# Altium schematic sheet Main.SchDoc
size 271 x 238 mm; SheetNumber: 1
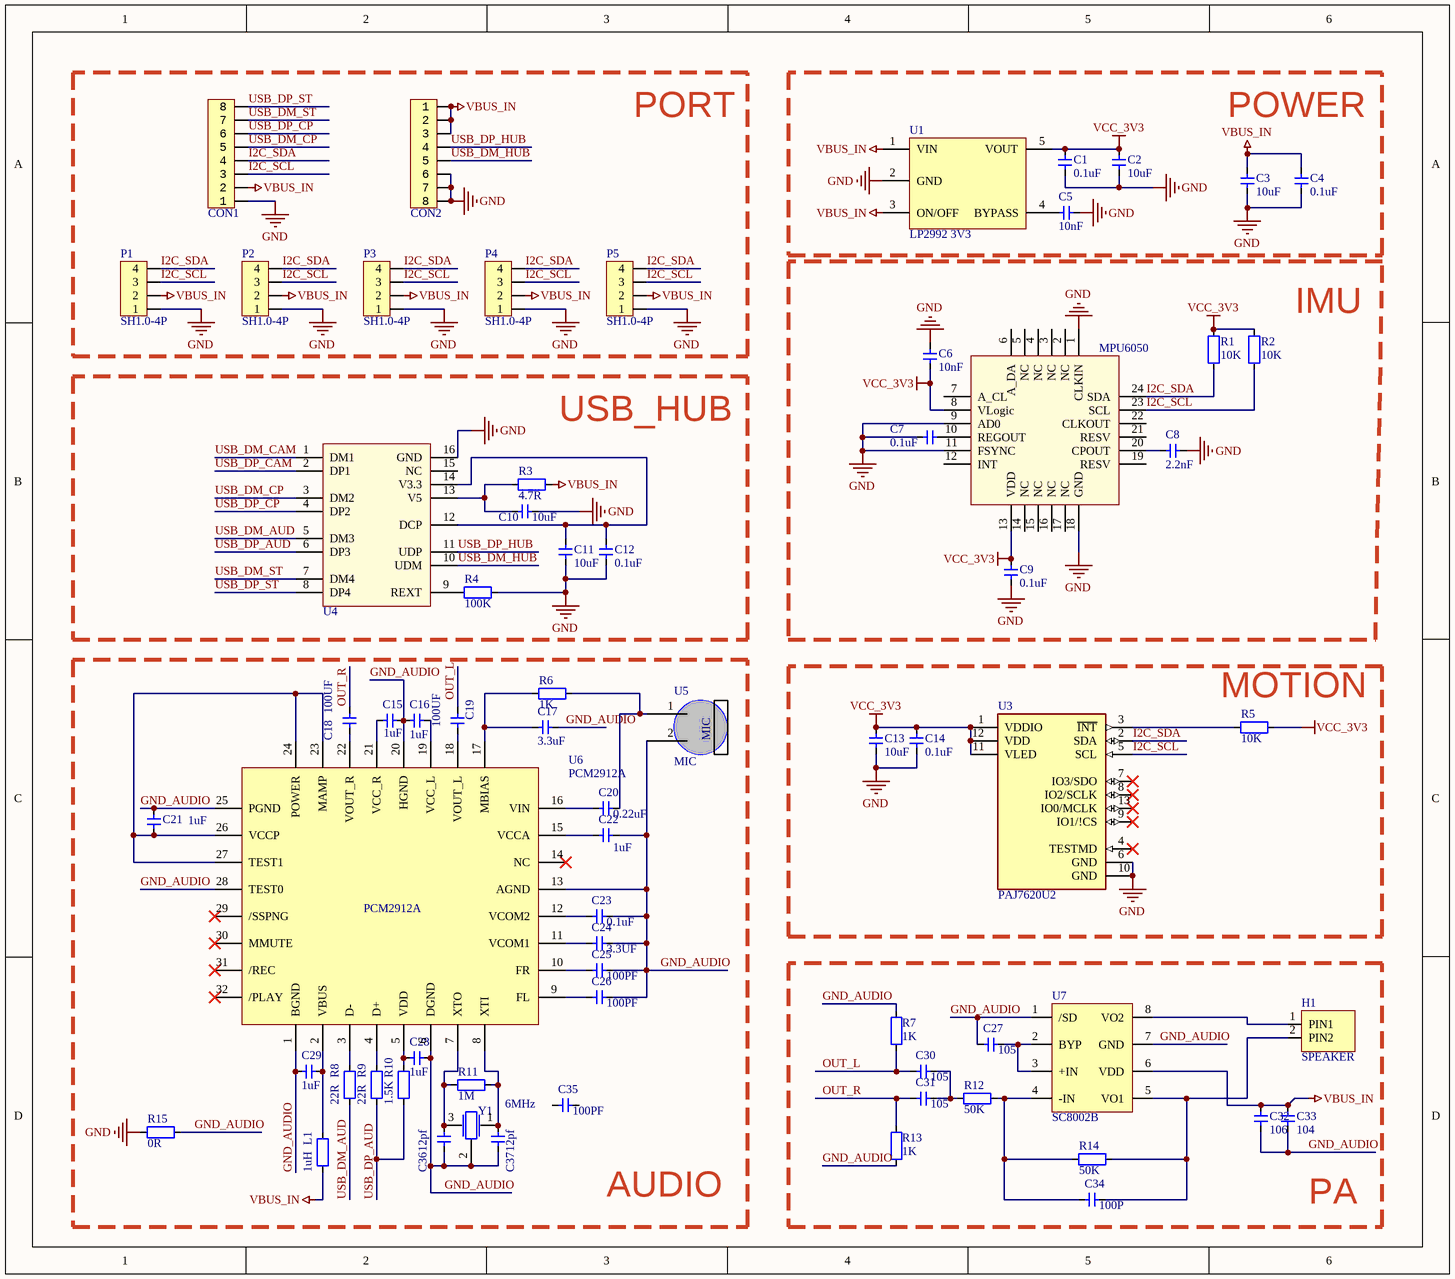
[diagram p0: Main.SchDoc]

## Parts
C1  0.1uF  [CAP_0402]
C2  10uF  [CAP_0402]
C3  10uF  [CAP_0402]
C4  0.1uF  [CAP_0402]
C5  10nF  [CAP_0402]
C6  10nF  [CAP_0402]
C7  0.1uF  [CAP_0402]
C8  2.2nF  [CAP_0402]
C9  0.1uF  [CAP_0402]
C10  10uF  [CAP_0402]
C11  10uF  [CAP_0402]
C12  0.1uF  [CAP_0402]
C13  10uF  [CAP_0402]
C14  0.1uF  [CAP_0402]
C15  1uF  [CAP_0402]
C16  1uF  [CAP_0402]
C17  3.3uF  [CAP_0402]
C18  100UF  [3225_C]
C19  100UF  [3225_C]
C20  0.22uF  [CAP_0402]
C21  1uF  [CAP_0402]
C22  1uF  [CAP_0402]
C23  0.1uF  [CAP_0402]
C24  3.3UF  [CAP_0402]
C25  100PF  [CAP_0402]
C26  100PF  [CAP_0402]
C27  105  [CAP_0402]
C28  1uF  [CAP_0402]
C29  1uF  [CAP_0402]
C30  105  [CAP_0402]
C31  105  [CAP_0402]
C32  106  [CAP_0402]
C33  104  [CAP_0402]
C34  100P  [CAP_0402]
C35  100PF  [CAP_0402]
C36  12pf  [CAP_0402]
C37  12pf  [CAP_0402]
CON1  FFC_0.5_8  [FFC_0.5_8]  (value not drawn)
CON2  FFC_0.5_8  [FFC_0.5_8]  (value not drawn)
H1  SPEAKER  [header2p_1.0]
L1  1uH  [RES_0402]
P1  SH1.0-4P  [SH1.0-4P]
P2  SH1.0-4P  [SH1.0-4P]
P3  SH1.0-4P  [SH1.0-4P]
P4  SH1.0-4P  [SH1.0-4P]
P5  SH1.0-4P  [SH1.0-4P]
R1  10K  [RES_0402]
R2  10K  [RES_0402]
R3  4.7R  [RES_0402]
R4  100K  [RES_0402]
R5  10K  [RES_0402]
R6  1K  [RES_0402]
R7  1K  [RES_0402]
R8  22R  [RES_0402]
R9  22R  [RES_0402]
R10  1.5K  [RES_0402]
R11  1M  [RES_0402]
R12  50K  [RES_0402]
R13  1K  [RES_0402]
R14  50K  [RES_0402]
R15  0R  [RES_0402]
U1  LP2992 3V3  [SOT23-5]
U2  MPU6050  [QFN-24]
U3  PAJ7620U2  [PAJ7620U2]
U4  HS8836A  [SO-16N]  (value not drawn)
U5  MIC  [MIC6*2.2]
U6  PCM2912A  [PCM2912]
U7  SC8002B  [SOP-8]
Y1  6MHz  [cystal-3P -4520]

## Blocks framed on the sheet
PORT: CON1 CON2 P1-P5
POWER: C1-C5 U1
IMU: C6-C9 R1 R2 U2
USB_HUB: C10-C12 R3 R4 U4
AUDIO: C15-C26 C28 C29 C35-C37 L1 R6 R8-R11 R15 U5 U6 Y1
MOTION: C13 C14 R5 U3
PA: C27 C30-C34 H1 R7 R12-R14 U7

## Nets
GND: C1.1 C2.1 C3.1 C4.1 C5.1 C6.2 C7.2 C8.1 C9.1 C10.1 C11.2 C12.2 C13.2 C14.2 CON1.1 CON2.6 CON2.7 CON2.8 P1.1 P2.1 P3.1 P4.1 P5.1 R4.1 R15.1 U1.2(GND) U2.1(CLKIN) U2.9(AD0) U2.11(FSYNC) U2.18(GND) U3.6(GND) U3.10(GND) U4.16(GND)
VBUS_IN: C3.2 C4.2 C32.1 C33.1 CON1.2 CON2.1 CON2.2 CON2.3 L1.2 P1.2 P2.2 P3.2 P4.2 P5.2 R3.1 U1.1(VIN) U1.3(ON/OFF) U7.6(VDD)
VCC_3V3: C1.2 C2.2 C6.1 C9.2 C13.1 C14.1 R1.2 R2.2 R5.2 U1.5(VOUT) U2.8(VLogic) U2.13(VDD) U3.1(VDDIO) U3.11(VLED) U3.12(VDD)
GND_AUDIO: C15.2 C16.2 C17.2 C21.2 C22.2 C23.1 C24.1 C25.1 C26.1 C27.2 C28.1 C29.2 C32.2 C33.2 C36.2 C37.2 R7.1 R13.1 R15.2 U5.2 U6.1(BGND) U6.6(DGND) U6.13(AGND) U6.20(HGND) U6.25(PGND) U6.28(TEST0) U7.1(/SD) U7.7(GND) Y1.2
I2C_SCL: CON1.3 P1.3 P2.3 P3.3 P4.3 P5.3 R2.1 U2.23(SCL) U3.5(SCL)
I2C_SDA: CON1.4 P1.4 P2.4 P3.4 P4.4 P5.4 R1.1 U2.24(SDA) U3.2(SDA)
OUT_L: C19.2 C30.2 R7.2
OUT_R: C18.2 C31.2 R13.2
USB_DM_AUD: R8.2 U4.5(DM3)
USB_DM_CAM: U4.1(DM1)
USB_DM_CP: CON1.5 U4.3(DM2)
USB_DM_HUB: CON2.5 U4.10(UDM)
USB_DM_ST: CON1.7 U4.7(DM4)
USB_DP_AUD: R9.2 R10.2 U4.6(DP3)
USB_DP_CAM: U4.2(DP1)
USB_DP_CP: CON1.6 U4.4(DP2)
USB_DP_HUB: CON2.4 U4.11(UDP)
USB_DP_ST: CON1.8 U4.8(DP4)
NetC5_2: C5.2 U1.4(BYPASS)
NetC7_1: C7.1 U2.10(REGOUT)
NetC8_2: C8.2 U2.20(CPOUT)
NetC10_2: C10.2 R3.2 U4.13(V5)
NetC11_1: C11.1 C12.1 U4.12(DCP) U4.14(V3.3)
NetC15_1: C15.1 U6.21(VCC_R)
NetC16_1: C16.1 U6.19(VCC_L)
NetC17_1: C17.1 R6.1 U6.17(MBIAS)
NetC18_1: C18.1 U6.22(VOUT_R)
NetC19_1: C19.1 U6.18(VOUT_L)
NetC20_1: C20.1 U6.16(VIN)
NetC20_2: C20.2 R6.2 U5.1
NetC21_1: C21.1 U6.23(MAMP) U6.24(POWER) U6.26(VCCP) U6.27(TEST1)
NetC22_1: C22.1 U6.15(VCCA)
NetC23_2: C23.2 U6.12(VCOM2)
NetC24_2: C24.2 U6.11(VCOM1)
NetC25_2: C25.2 U6.10(FR)
NetC26_2: C26.2 U6.9(FL)
NetC27_1: C27.1 U7.2(BYP) U7.3(+IN)
NetC28_2: C28.2 R10.1 U6.5(VDD)
NetC29_1: C29.1 L1.1 U6.2(VBUS)
NetC30_1: C30.1 C31.1 R12.1
NetC34_1: C34.1 H1.2(PIN2) R14.2 U7.5(VO1)
NetC34_2: C34.2 R12.2 R14.1 U7.4(-IN)
NetC36_1: C36.1 R11.1 U6.7(XTO) Y1.3
NetC37_1: C37.1 R11.2 U6.8(XTI) Y1.1
NetH1_1: H1.1(PIN1) U7.8(VO2)
NetR4_2: R4.2 U4.9(REXT)
NetR5_1: R5.1 U3.3(~{INT})
NetR8_1: R8.1 U6.3(D-)
NetR9_1: R9.1 U6.4(D+)

Not connected (* = marked no-connect by the designer): C35 1 2; U2 2(NC) 3(NC) 4(NC) 5(NC) 6(A_DA) 7(A_CL) 12(INT) 14(NC) 15(NC) 16(NC) 17(NC) 19(RESV) 21(RESV) 22(CLKOUT); U3 4(TESTMD)* 7(IO3/SDO)* 8(IO2/SCLK)* 9(IO1/!CS)* 13(IO0/MCLK)*; U4 15(NC); U6 14(NC)* 29(/SSPNG)* 30(MMUTE)* 31(/REC)* 32(/PLAY)*

## Library data of the parts
C1-C37 = 电容-0402: Capacitor; Value: 0.1u
CON1 CON2 = FFC_0.5_8: FFC
H1 = HEADER-2P
L1 R1-R7 R10-R15 = 电阻-0402: Resistor; Value: 22R
R8 R9 = 电阻-0402: Resistor; Value: 22R
U1 = LP2992: LDO
U2 = MPU6050: 六轴传感器
U3 = PAJ7620U2: module sensorPAJ7620U2 : 54/TRAY, 5400/BOX, 32400/CARTON; MF: Pixart; Value: *; Check_prices: https://www.snapeda.com/parts/PAJ7620U2/PixArt/view-part/?ref=eda; Price: None; Package: None; SnapEDA_Link: https://www.snapeda.com/parts/PAJ7620U2/PixArt/view-part/?ref=snap; Availability: Not in stock; MP: PAJ7620U2
U4 = HS8836A: USB2.0 HUB
Y1 = 晶振-3Pin: 村田贴片